# Altium schematic sheet 05-Power.SchDoc
size A; SheetNumber: 16; SheetTotal: 16
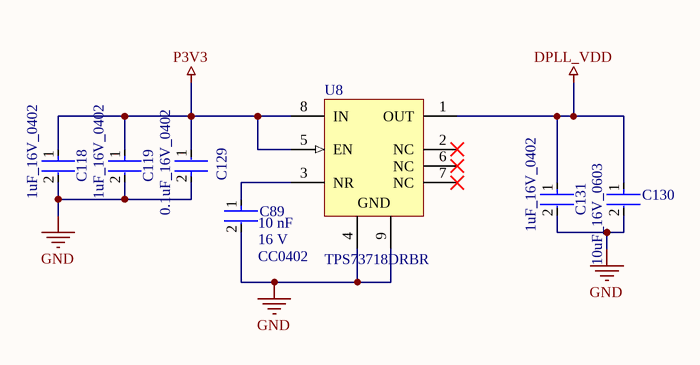
[diagram p0: 05-Power.SchDoc]

## Parts
C89  value 10 nF  Package: CC0402  Voltage Rating: 16 V  [FP-CC0402-MFG]  (hidden comment: CC0402KRX7R7BB103)
C118  1uF_16V_0402  [FP-0402-L_1_0_0_05-W_0_5-IPC_C]
C119  1uF_16V_0402  [FP-0402-L_1_0_0_05-W_0_5-IPC_C]
C129  0.1uF_16V_0402  [FP-GRM15-MFG]
C130  10uF_16V_0603  [FP-MK107BA-IPC_A]
C131  1uF_16V_0402  [FP-0402-L_1_0_0_05-W_0_5-IPC_C]
U8  TPS73718DRBR  [DRB0008A_V]

## Nets
DPLL_VDD: C130.1 C131.1 U8.1(OUT)
GND: C89.2 C118.2 C119.2 C129.2 C130.2 C131.2 U8.4(GND) U8.9(GND)
P3V3: C118.1 C119.1 C129.1 U8.5(EN) U8.8(IN)
NetC89_1: C89.1 U8.3(NR)

Not connected (* = marked no-connect by the designer): U8 2(NC)* 6(NC)* 7(NC)*

## Library data of the parts
C89 = CMP-03422-000501-1: CAP CER 10000PF 16V X7R 0402; Manufacturer: YAGEO; Automotive Grade: NA; Material: Ceramic; Tolerance: 0.1; Temperature Coefficient: 30ppm/°C; Temperature Range Low: -55°C; Temperature Range High: +125°C; Mouser Description: 0402 10 nF 16 V ±10 % Tolerance X7R SMT Multilayer Ceramic Capacitor; Footprint Url: http://www.yageo.com/exep/pages/download/literatures/UPY-C_GEN_24.pdf; Category: Cap; RoHS: TRUE; Capacitance: 10 nF; Manufacturer Part Number: CC0402KRX7R7BB103; ComponentLink2Description: Datasheet; Ipc Land Pattern Name: CAPC10050X50; Automotive: No; ComponentLink2URL: http://www.yageo.com/documents/recent/UPY-GP_NP0_16V-to-50V_16.pdf; Device Class L1: Passive Components; Height: 0.55mm; Temperature Characteristic: X7R; Device Class L3: Ceramic Capacitors; Lead Free: Yes; Device Class L2: Capacitors; Digikey Description: CAP CER 10000PF 16V X7R 0402; Octopart: https://octopart.com/cc0402krx7r7bb103-yageo-192895; Temperature: -55°C to +125°C
C118 C119 C131 = CMP-14477-003537-2: None; Tolerance: 20%; Voltage Rating (DC): 16V; Capacitance: 1uF; Dielectric: X5R; Height: 0.5mm; Package Quantity: 10000; Series: M; Max Operating Temperature: 85°C; Width: 0.02inch; Mount: Surface Mount; Thickness: 0.022inch; Length: 1mm; Min Operating Temperature: -55°C; Depth: 0.5mm; RoHS Compliant: Yes; Construction: Flat; Case/Package: 0402; Radiation Hardening: No; Packaging: Tape and Reel; Voltage: 16V; Voltage Rating: 16V; Halogen Free: Halogen Free
C129 = CMP-2100-03641-2: CAP CER 0.1UF 16V X7R 0402; Manufacturer Part Number: GRM155R71C104KA88D; Manufacturer: Murata; Standoff Height: 0mm; Tolerance: 10%; Voltage Rating: 16Vdc; Material: Ceramic; Capacitance: 0.10μF; Value: 0.10μF; RoHS: TRUE; Temperature Characteristic: X7R; Octopart: https://octopart.com/grm155r71c104ka88d-murata-196880; Digikey Description: CAP CER 0.1UF 16V X7R 0402; Device Class L3: Ceramic Capacitors; Height: 0.55mm; ComponentLink2Description: Datasheet; Temperature Range Low: -55°C; Ipc Land Pattern Name: CAPC10050X219; ComponentLink2URL: https://search.murata.co.jp/Ceramy/image/img/A01X/G101/ENG/GRM155R71H471KA01-01A.pdf; Device Class L1: Passive Components; Lead Free: yes; Category: Cap; Package: GRM15; Temperature: -55°C to +125°C; Device Class L2: Capacitors; Temperature Range High: +125°C; Mouser Description: 0402 0.1 uF 16V ±10 % Tolerance X7R SMT Multilayer Ceramic Capacitor
C130 = CMP-2000-06226-3: None; Dielectric: X5R; Voltage Rating: 16V; Tolerance: 20%; Capacitance: 10uF; Packaging: Tape and Reel; Mount: Surface Mount; Height: 0.8mm; Series: M; Min Operating Temperature: -55°C; Max Operating Temperature: 85°C; Thickness: 0.031inch; Construction: Flat; Case/Package: 0603; Case Code (Metric): 1608; Package Quantity: 1; Case Code (Imperial): 0603; Voltage Rating (DC): 16V; Halogen Free: Halogen Free; Length: 0.063inch; Width: 0.031inch; Termination: SMD/SMT; RoHS Compliant: Yes
U8 = CMP-0395-00613-2: Single Output LDO, 1 A, Fixed 1.8 V Output, 2.2 to 5.5 V Input, with Reverse Current Protection, 8-pin SON (DRB), -40 to 125 degC, Green (RoHS & no Sb/Br); Manufacturer: Texas Instruments; Fixed Output Options(V): 1.8; Vin(Min)(V): 2.2; Iq(Typ)(mA): 0.3; Accuracy(%): 3; Vdo(Typ)(mV): 130; SubFamily: Single Channel LDO; Vin(Max)(V): 5.5; Iout(Max)(A): 1; Rating: Catalog; Vout Adj(Min)(V): 1.8; ComponentLink2Description: Datasheet; PartNumber: TPS73718DRBR; Vout Adj(Max)(V): 1.8; ComponentLink3URL: http://www.ti.com/litv/pdf/mpds118h; PackageDescription: 8-Pin Plastic Small Outline, Body 3 x 3 mm, Pitch 0.65 mm; ComponentLink1Description: Manufacturer URL; ComponentLink1URL: http://www.ti.com/; ComponentLink3Description: Package Specification; PackageVersion: 4203482-2/K; Eco-Plan: Green (RoHS & no Sb/Br); PackageReference: DRB0008A; Mounting Technology: Surface Mount; ComponentLink2URL: http://www.ti.com/general/docs/lit/getliterature.tsp?genericPartNumber=TPS73718&fileType=pdf; DatasheetVersion: SBVS067O